# EAGLE design t167 (EAGLE 7.7.0)
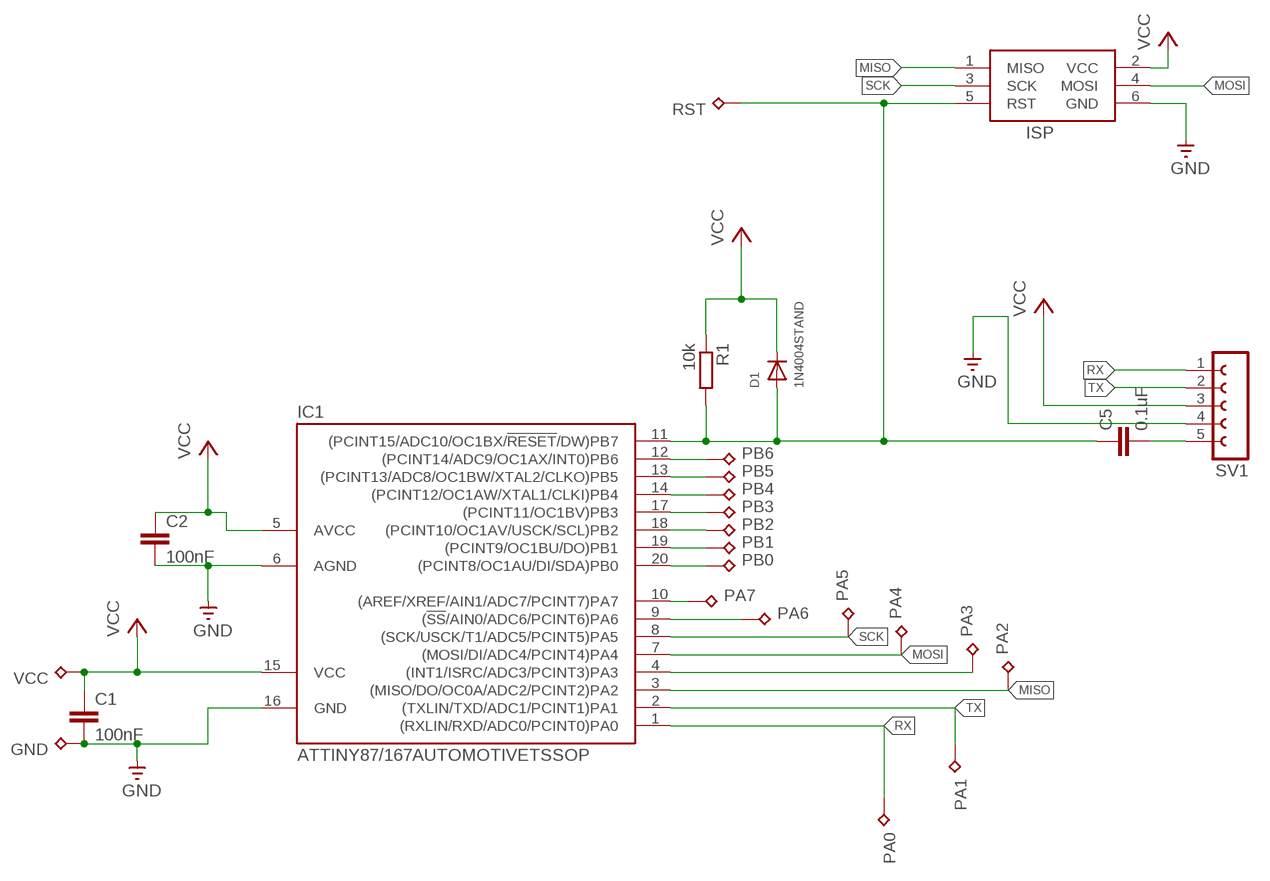
[diagram p0: schematic, sheet 1]

## Parts
C1  100nF  C-EUC0805  [C0805]
C2  100nF  C-EUC0805  [C0805]
C5  0.1uF  C-EUC0805K  [C0805K]
D1  1N4004STAND  DIODESOD-323F  [SOD-323F]
GND  1XPIN-HEADER  [1XPIN-HEADER]
IC1  ATTINY87/167AUTOMOTIVETSSOP  [TSSOP20]
ISP  AVRISP-6  [AVRISP]
PA0  1XPIN-HEADER  [1XPIN-HEADER]
PA1  1XPIN-HEADER  [1XPIN-HEADER]
PA2  1XPIN-HEADER  [1XPIN-HEADER]
PA3  1XPIN-HEADER  [1XPIN-HEADER]
PA4  1XPIN-HEADER  [1XPIN-HEADER]
PA5  1XPIN-HEADER  [1XPIN-HEADER]
PA6  1XPIN-HEADER  [1XPIN-HEADER]
PA7  1XPIN-HEADER  [1XPIN-HEADER]
PB0  1XPIN-HEADER  [1XPIN-HEADER]
PB1  1XPIN-HEADER  [1XPIN-HEADER]
PB2  1XPIN-HEADER  [1XPIN-HEADER]
PB3  1XPIN-HEADER  [1XPIN-HEADER]
PB4  1XPIN-HEADER  [1XPIN-HEADER]
PB5  1XPIN-HEADER  [1XPIN-HEADER]
PB6  1XPIN-HEADER  [1XPIN-HEADER]
R1  10k  R-EU_M0805  [M0805]
RST  1XPIN-HEADER  [1XPIN-HEADER]
SV1  FE05-1  [FE05-1]
VCC  1XPIN-HEADER  [1XPIN-HEADER]

## Nets
GND: C1.2 C2.2 GND.P$1 IC1.6(AGND) IC1.16(GND) ISP.6(GND) SV1.4
MISO: IC1.3((MISO/DO/OC0A/ADC2/PCINT2)PA2) ISP.1(MISO) PA2.P$1
MOSI: IC1.7((MOSI/DI/ADC4/PCINT4)PA4) ISP.4(MOSI) PA4.P$1
N$1: IC1.4((INT1/ISRC/ADC3/PCINT3)PA3) PA3.P$1
N$2: C5.2 SV1.5
N$3: IC1.9((!SS!/AIN0/ADC6/PCINT6)PA6) PA6.P$1
N$4: IC1.10((AREF/XREF/AIN1/ADC7/PCINT7)PA7) PA7.P$1
N$5: IC1.18((PCINT10/OC1AV/USCK/SCL)PB2) PB2.P$1
N$6: IC1.20((PCINT8/OC1AU/DI/SDA)PB0) PB0.P$1
N$7: IC1.19((PCINT9/OC1BU/DO)PB1) PB1.P$1
N$8: IC1.17((PCINT11/OC1BV)PB3) PB3.P$1
N$9: IC1.14((PCINT12/OC1AW/XTAL1/CLKI)PB4) PB4.P$1
N$10: IC1.13((PCINT13/ADC8/OC1BW/XTAL2/CLKO)PB5) PB5.P$1
N$11: IC1.12((PCINT14/ADC9/OC1AX/INT0)PB6) PB6.P$1
RST: C5.1 D1.A IC1.11((PCINT15/ADC10/OC1BX/!RESET!/DW)PB7) ISP.5(RST) R1.2 RST.P$1
RX: IC1.1((RXLIN/RXD/ADC0/PCINT0)PA0) PA0.P$1 SV1.1
SCK: IC1.8((SCK/USCK/T1/ADC5/PCINT5)PA5) ISP.3(SCK) PA5.P$1
TX: IC1.2((TXLIN/TXD/ADC1/PCINT1)PA1) PA1.P$1 SV1.2
VCC: C1.1 C2.1 D1.C IC1.5(AVCC) IC1.15(VCC) ISP.2(VCC) R1.1 SV1.3 VCC.P$1

## Notes on the sheet
- X4 OR X41

## Library data of the parts
C1 C2 C5 = rcl:C-EU: CAPACITOR, European symbol
D1 = adafruit:DIODE: Diode SMADIODE - SMA Surface Mount Package 20V 1A Schottky Diode Digikey: 641-1014-6-ND DO-1N4148 - Through Hole Small Current Diode SOD-123 20V 1 A (.5mV Vf) Schottky Diode - Digikey: MBRX120TPMSCT-ND SOD-323 10V 570mA (.38mV Vf, 3ns) Schottky Diode - Digikey: ZLLS410CT-ND SOD-523 30V 30mA Schottky Diode (RB751S-40TE61) - Digikey: RB751S-40TE61CT-ND SOT23-R/W - SOT23 Package (R = Solder Paste/Reflow Ovens, W = Hand-Soldering) BAT54Film 40V 300mA - Digikey: 497-7162-1-ND
GND PA0 PA1-PA7 PB0 PB1-PB6 RST VCC = my lib:1XPIN-HEADER
IC1 = attiny87_167_automotive:ATTINY87/167AUTOMOTIVE
ISP = adafruit:AVRISP: AVR ISP HEADER Standard 6 pin header for AVR programming
R1 = rcl:R-EU_: RESISTOR, European symbol
SV1 = con-lsta:FE05-1: FEMALE HEADER; OC_FARNELL: unknown; OC_NEWARK: unknown

## Board
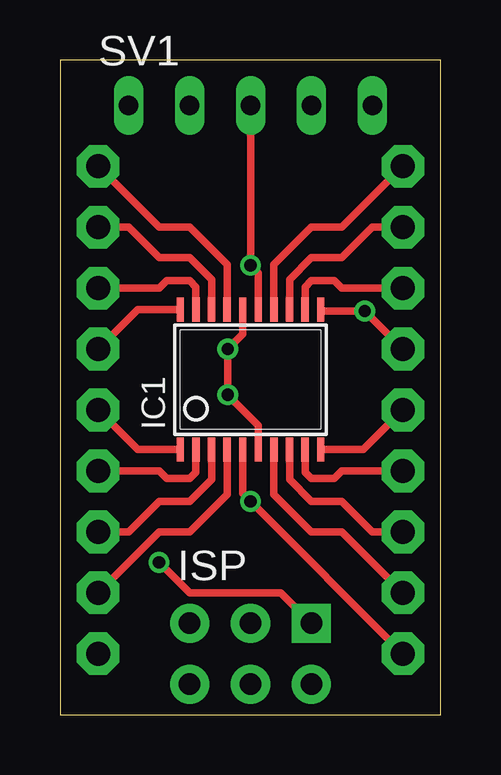
[diagram p1: board, top side]
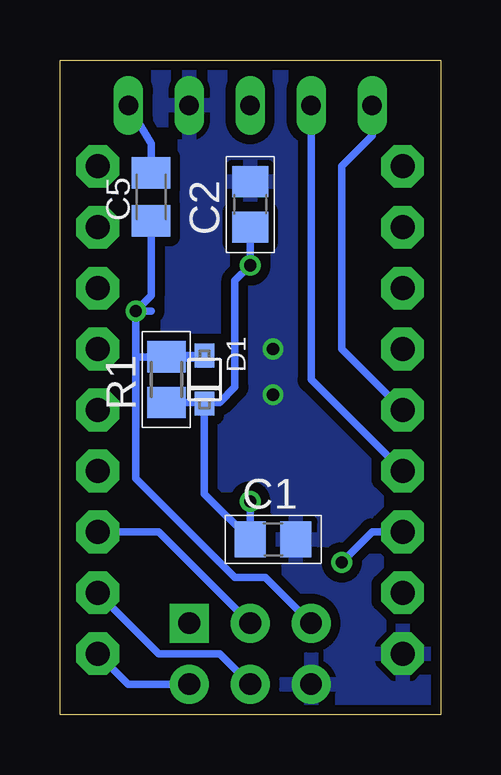
[diagram p2: board, bottom side, seen from below]

Size 15.86 x 27.3 mm. Coordinates in mm from the lower left corner, seen from the top.
Outline: 0,0 15.86,0 15.86,27.3 0,27.3 0,0
Copper layers (1*16): Top 0.0356mm / dielectric 1.5011mm / Bottom 0.0356mm
Design rules "OSHPark Rules": minimum track width 6mil, minimum drill 13mil, track to track 6mil, track to pad 6mil, pad to pad 6mil, via to via 6mil, smd to smd 6mil, copper to edge 15mil, drill to drill 6mil, minimum pad ring 7mil, minimum via ring 7mil, stop-mask expansion 3mil, vias tented up to drill 0mil, thermal gap 10mil

### Footprints (pad centres in the part's own frame; a part is rotated, then mirrored left to right if it is on the bottom)
C0805 = smd 1.3 x 1.5: 1 -0.95,0; 2 0.95,0
C0805K = smd 1.3 x 1.6: 1 -1,0; 2 1,0
SOD-323F = smd 1 x 0.8: A -1,0; C 1,0
1XPIN-HEADER = drill 1 pad 1.778 octagon: P$1 0,0
TSSOP20 = smd 0.305 x 0.991: 1 -2.925,-2.918; 2 -2.275,-2.918; 3 -1.625,-2.918; 4 -0.975,-2.918; 5 -0.325,-2.918; 6 0.325,-2.918; 7 0.975,-2.918; 8 1.625,-2.918; 9 2.275,-2.918; 10 2.925,-2.918; 11 2.925,2.918; 12 2.275,2.918; 13 1.625,2.918; 14 0.975,2.918; 15 0.325,2.918; 16 -0.325,2.918; 17 -0.975,2.918; 18 -1.625,2.918; 19 -2.275,2.918; 20 -2.925,2.918
AVRISP = drill 0.9 pad 1.626 square: 1 -1.27,2.54 | drill 0.9 pad 1.626: 2 1.27,2.54; 3 -1.27,0; 4 1.27,0; 5 -1.27,-2.54; 6 1.27,-2.54
M0805 = smd 1.3 x 1.6: 1 -0.95,0; 2 0.95,0
FE05-1 = drill 0.813 long: 1 -5.08,0; 2 -2.54,0; 3 0,0; 4 2.54,0; 5 5.08,0

### Placement (x,y rotation side)
C1  6.99,7.3 0 bottom
C2  7.94,21.27 90 bottom
C5  12.07,21.59 90 bottom
D1  9.84,13.97 270 bottom
GND  1.59,2.54 0 top
IC1  7.94,13.97 0 top
ISP  7.94,2.54 270 top
PA0  1.59,12.7 0 top
PA1  1.59,10.16 0 top
PA2  1.59,7.62 0 top
PA3  1.59,5.08 0 top
PA4  14.29,5.08 0 top
PA5  14.29,7.62 0 top
PA6  14.29,10.16 0 top
PA7  14.29,12.7 0 top
PB0  1.59,15.24 0 top
PB1  1.59,17.78 0 top
PB2  1.59,20.32 0 top
PB3  1.59,22.86 0 top
PB4  14.29,22.86 0 top
PB5  14.29,20.32 0 top
PB6  14.29,17.78 0 top
R1  11.43,13.97 90 bottom
RST  14.29,15.24 0 top
SV1  7.94,25.4 0 top
VCC  14.29,2.54 0 top

### Tracks (layer width: path | path; a pad name or v marks a point on that pad's centre or on a via)
GND  (via drill 0.51)
  Top 0.305: IC1.16 7.61,15.87 v6.99,15.24 v6.99,13.33 8.26,12.06 IC1.6
  pour Bottom (isolate 0.406): 0,27.3 15.88,27.3 15.88,0 0,0
MISO  (via drill 0.51)
  Top 0.305: IC1.3 6.31,9.8 5.4,8.89 4.13,8.89 2.86,7.62 PA2.P$1 | ISP.1 9.21,5.08 5.4,5.08 v4.13,6.35
  Bottom 0.305: PA2.P$1 2.86,7.62 v4.13,6.35
MOSI
  Top 0.305: IC1.7 8.91,9.19 10.48,7.62 11.75,7.62 PA4.P$1
  Bottom 0.305: ISP.4 9.21,2.54 11.75,2.54 PA4.P$1
N$1
  Top 0.305: IC1.4 6.96,9.19 5.4,7.62 4.13,7.62 PA3.P$1
N$2
  Bottom 0.305: SV1.5 12.07,23.81 C5.2
N$3
  Top 0.305: IC1.9 10.21,10.11 10.48,9.84 11.43,9.84 11.75,10.16 PA6.P$1
N$4
  Top 0.305: IC1.10 12.64,11.05 PA7.P$1
N$5
  Top 0.305: PB2.P$1 2.86,20.32 4.13,19.05 5.4,19.05 6.31,18.13 IC1.18
N$6
  Top 0.305: IC1.20 3.24,16.89 PB0.P$1
N$7
  Top 0.305: IC1.19 5.66,17.83 5.4,18.1 4.44,18.1 4.13,17.78 PB1.P$1
N$8
  Top 0.305: PB3.P$1 4.13,20.32 5.4,20.32 6.96,18.76 IC1.17
N$9
  Top 0.305: PB4.P$1 11.75,20.32 10.48,20.32 8.91,18.76 IC1.14
N$10
  Top 0.305: PB5.P$1 13.02,20.32 11.75,19.05 10.48,19.05 9.56,18.13 IC1.13
N$11
  Top 0.305: IC1.12 10.21,17.83 10.48,18.1 11.43,18.1 11.75,17.78 PB6.P$1
RST  (via drill 0.51)
  Top 0.305: RST.P$1 v12.7,16.83 10.92,16.83 IC1.11
  Bottom 0.305: ISP.5 7.3,5.71 8.57,5.71 12.7,9.84 v12.7,16.83 | v12.7,16.83 12.07,16.83 | C5.1 12.07,17.46 v12.7,16.83 | R1.2 12.7,14.92 v12.7,16.83
  Bottom 0.406: D1.A 9.89,14.92 R1.2 11.75,15.24
RX
  Top 0.305: IC1.1 3.24,11.05 PA0.P$1
  Bottom 0.305: PA0.P$1 4.13,15.24 4.13,22.86 2.86,24.13 SV1.1
SCK
  Top 0.305: PA5.P$1 13.02,7.62 11.75,8.89 10.48,8.89 9.56,9.8 IC1.8
  Bottom 0.305: ISP.3 11.75,7.62 PA5.P$1
TX
  Top 0.305: IC1.2 5.66,10.11 5.4,9.84 4.44,9.84 4.13,10.16 PA1.P$1
  Bottom 0.305: SV1.2 5.4,13.97 PA1.P$1
VCC  (via drill 0.51)
  Top 0.305: IC1.5 7.61,9.21 v7.94,8.89 VCC.P$1 | IC1.15 8.26,18.41 v7.94,18.73 SV1.3
  Bottom 0.305: v7.94,8.89 C1.1 9.84,9.21 D1.C 9.89,13.02 | R1.1 9.89,13.02 | ISP.2 13.02,1.27 VCC.P$1 | C2.1 v7.94,18.73 8.57,18.1 8.57,13.65 9.21,13.02 9.89,13.02

### Text on the board
SilkScreenTOP: RST / GND / VCC / TX / RX | ATtiny | x7 | ISP | 11 / 10 / 9 / 8 / 0 / 1 / 2 / 3 / GND | 12 / 13 / 14 / RST / 7 / 6 / 5 / 4 / VCC
SilkScreenBOTTOM: RST / GND / VCC / TX / RX